# Altium project AUTOMATIC_WATER_PUMPS_V1.PrjPcb
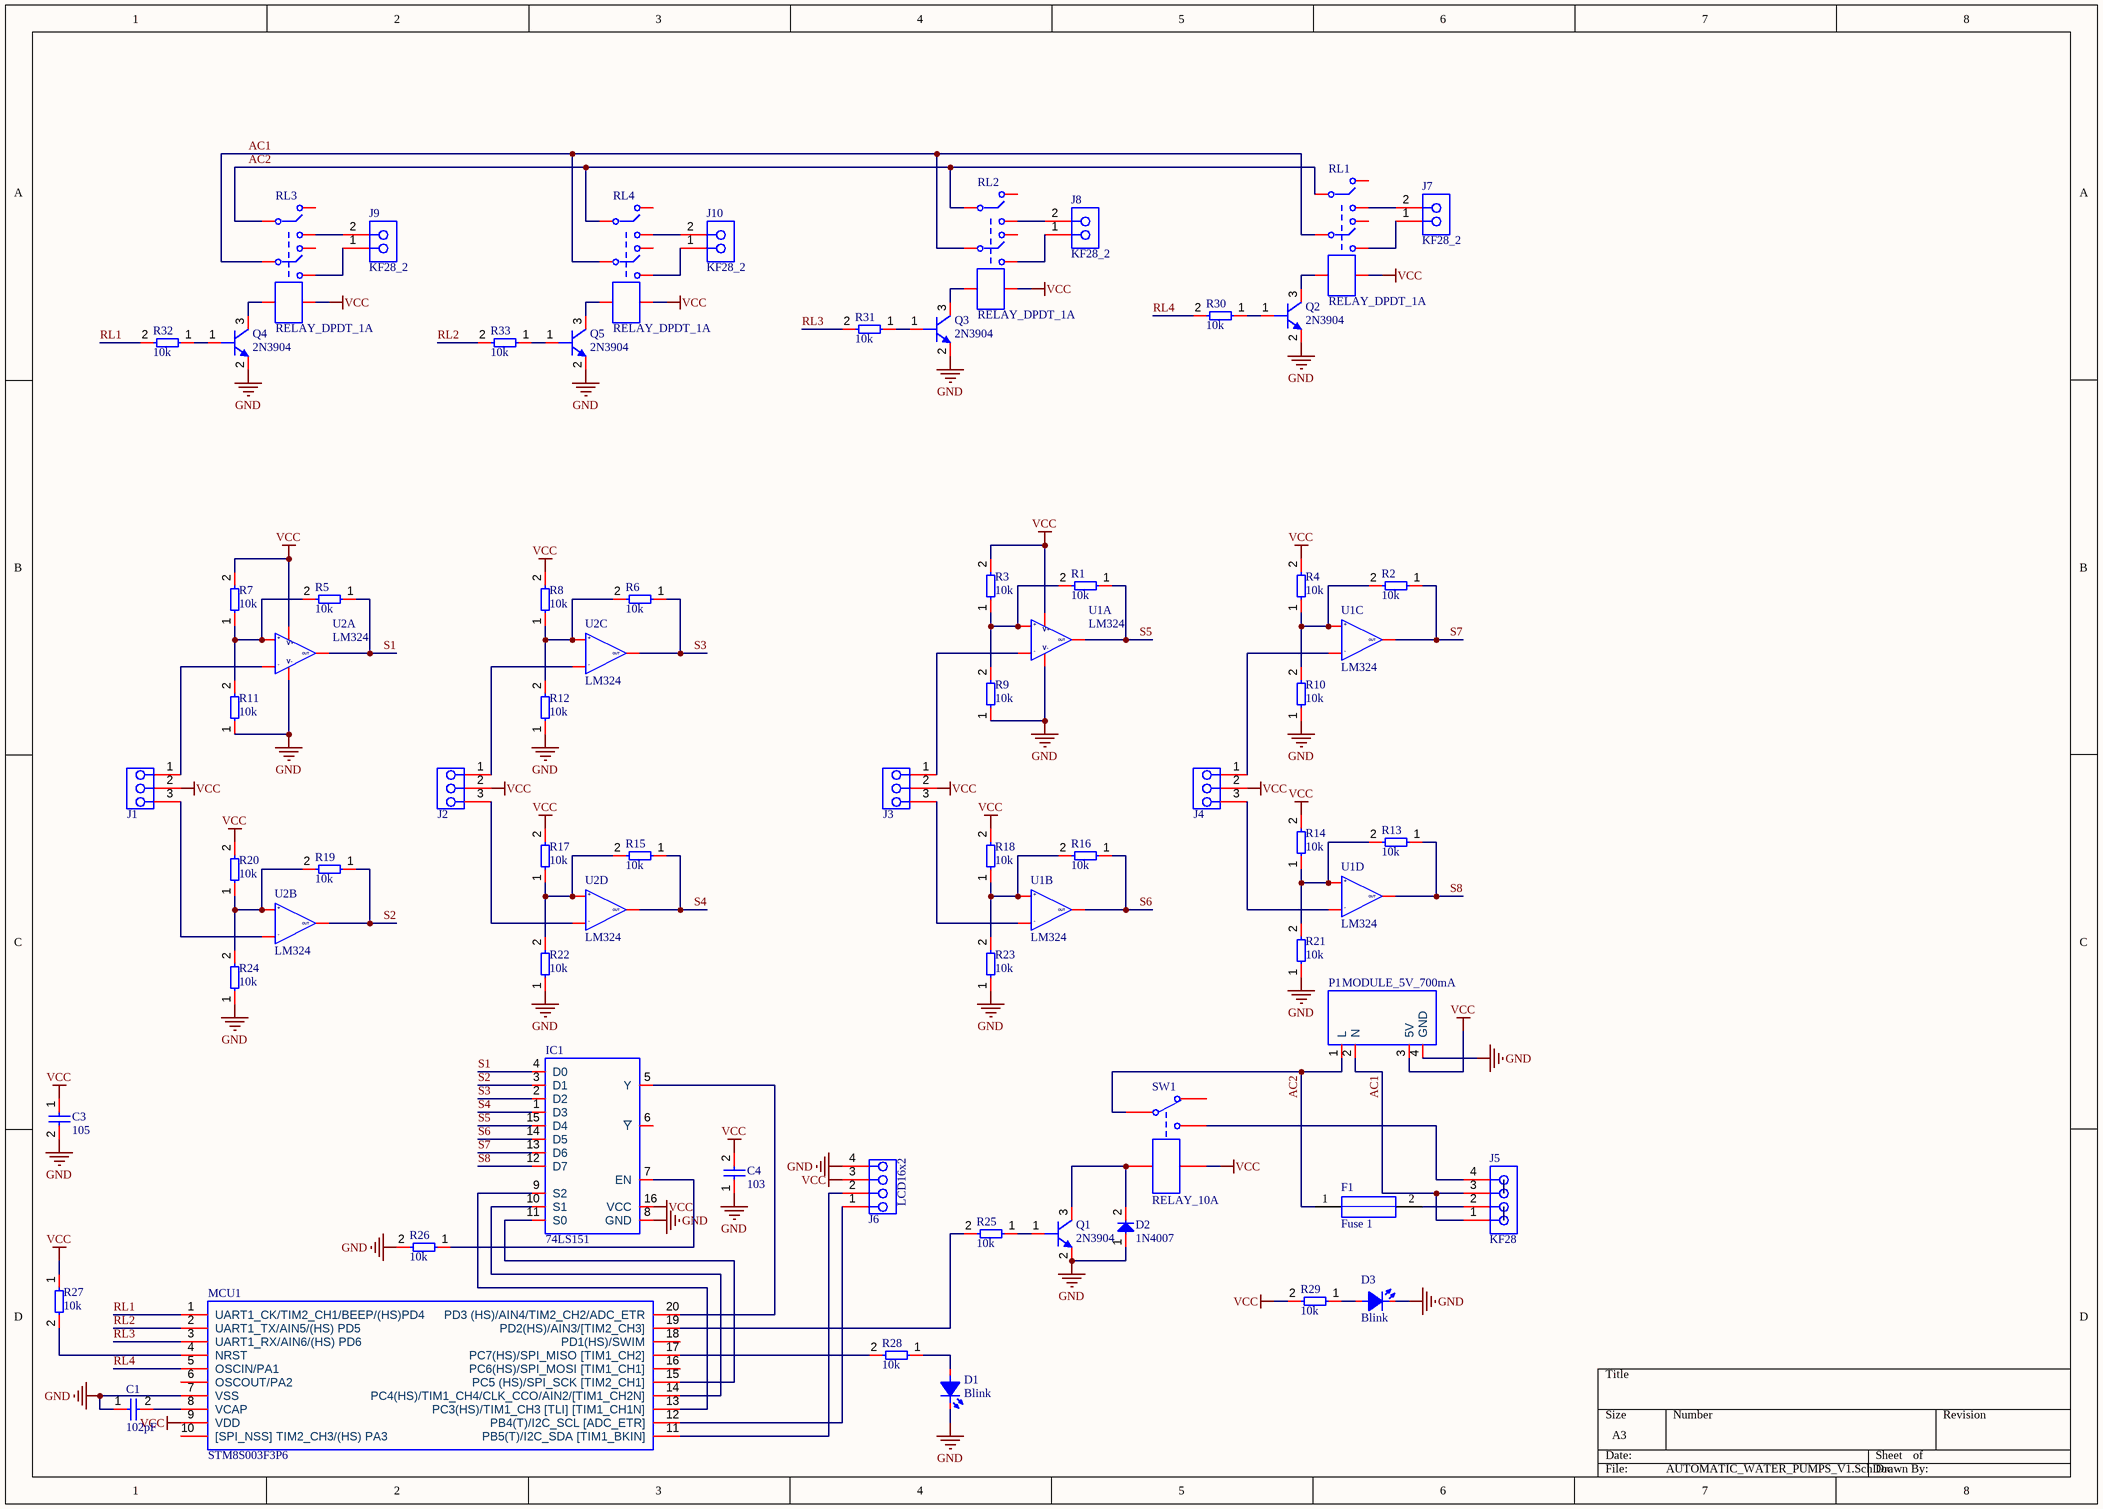
[diagram p0: AUTOMATIC_WATER_PUMPS_V1.SchDoc]
2 sheets, 107 parts. Net scope: global (net labels, ports and power ports of the same name join across sheets).
Board files: AUTOMATIC_WATER_PUMPS_V1.PcbDoc, DAUGHTER_BOARD.PcbDoc
Sheets:
  AUTOMATIC_WATER_PUMPS_V1.SchDoc
  DAUGHTER_BOARD.SchDoc

## Sheet AUTOMATIC_WATER_PUMPS_V1.SchDoc
size A3; SheetNumber: 1; SheetTotal: 1

### Parts
C1  102pF  [C0805]
C3  105  [C0805]
C4  103  [C0805]
D1  Blink  [L0805RED]
D2  1N4007  [DO-214AC(SMA)]
D3  Blink  [L0805RED]
F1  Fuse 1  [FUSE2]
IC1  74LS151  [SOP16]
J1  WT1  [JST - XH - Thru (R) - 3Pin - 2.54mm]  (value not drawn)
J2  WT2  [JST - XH - Thru (R) - 3Pin - 2.54mm]  (value not drawn)
J3  WT3  [JST - XH - Thru (R) - 3Pin - 2.54mm]  (value not drawn)
J4  WT4  [JST - XH - Thru (R) - 3Pin - 2.54mm]  (value not drawn)
J5  KF28  [HEADER_KF128_4_5.08MM]
J6  LCD16x2  [JST - XH - Thru (R) - 4Pin - 2.54mm]
J7  KF28_2  [HEADER_KF128_2_5.08MM]
J8  KF28_2  [HEADER_KF128_2_5.08MM]
J9  KF28_2  [HEADER_KF128_2_5.08MM]
J10  KF28_2  [HEADER_KF128_2_5.08MM]
MCU1  STM8S003F3P6  [TSSOP20_0.65_4.4]
P1  MODULE_5V_700mA  [MODULE_5V_700mA]
Q1  2N3904  [SOT23-3]
Q2  2N3904  [SOT23-3]
Q3  2N3904  [SOT23-3]
Q4  2N3904  [SOT23-3]
Q5  2N3904  [SOT23-3]
R1  10k  [R0805]
R2  10k  [R0805]
R3  10k  [R0805]
R4  10k  [R0805]
R5  10k  [R0805]
R6  10k  [R0805]
R7  10k  [R0805]
R8  10k  [R0805]
R9  10k  [R0805]
R10  10k  [R0805]
R11  10k  [R0805]
R12  10k  [R0805]
R13  10k  [R0805]
R14  10k  [R0805]
R15  10k  [R0805]
R16  10k  [R0805]
R17  10k  [R0805]
R18  10k  [R0805]
R19  10k  [R0805]
R20  10k  [R0805]
R21  10k  [R0805]
R22  10k  [R0805]
R23  10k  [R0805]
R24  10k  [R0805]
R25  10k  [R0805]
R26  10k  [R0805]
R27  10k  [R0805]
R28  10k  [R0805]
R29  10k  [R0805]
R30  10k  [R0805]
R31  10k  [R0805]
R32  10k  [R0805]
R33  10k  [R0805]
RL1  RELAY_DPDT_1A  [RELAY_DPDT_1A]
RL2  RELAY_DPDT_1A  [RELAY_DPDT_1A]
RL3  RELAY_DPDT_1A  [RELAY_DPDT_1A]
RL4  RELAY_DPDT_1A  [RELAY_DPDT_1A]
SW1  RELAY_10A  [RELAY_10A_5PIN]
U1  LM324  [SOP-14]  (parts A,B,C,D of 4)
U2  LM324  [SOP-14]  (parts A,B,C,D of 4)

### Nets
GND: C1.1 C3.2 C4.1 D1.2(K) D2.1 D3.2(K) IC1.8(GND) J6.4 MCU1.7(VSS) P1.4(GND) Q1.2(E) Q2.2(E) Q3.2(E) Q4.2(E) Q5.2(E) R9.1 R10.1 R11.1 R12.1 R21.1 R22.1 R23.1 R24.1 R26.2 U1.11 U2.11
VCC: C3.1 C4.2 IC1.16(VCC) J1.2 J2.2 J3.2 J4.2 J6.3 MCU1.9(VDD) P1.3(5V) R3.2 R4.2 R7.2 R8.2 R14.2 R17.2 R18.2 R20.2 R27.1 R29.2 RL1.8 RL2.8 RL3.8 RL4.8 SW1.3 U1.4 U2.4
AC1: J5.1 J5.3 P1.2(N) RL1.5 RL2.5 RL3.5 RL4.5
AC2: F1.1 P1.1(L) RL1.2 RL2.2 RL3.2 RL4.2 SW1.2
RL1: MCU1.1(UART1_CK/TIM2_CH1/BEEP/(HS)PD4) R32.2
RL2: MCU1.2(UART1_TX/AIN5/(HS)_PD5) R33.2
RL3: MCU1.3(UART1_RX/AIN6/(HS)_PD6) R31.2
RL4: MCU1.5(OSCIN/PA1) R30.2
S1: IC1.4(D0) R5.1 U2.1(OUT)
S2: IC1.3(D1) R19.1 U2.7(OUT)
S3: IC1.2(D2) R6.1 U2.8(OUT)
S4: IC1.1(D3) R15.1 U2.14(OUT)
S5: IC1.15(D4) R1.1 U1.1(OUT)
S6: IC1.14(D5) R16.1 U1.7(OUT)
S7: IC1.13(D6) R2.1 U1.8(OUT)
S8: IC1.12(D7) R13.1 U1.14(OUT)
NetC1_2: C1.2 MCU1.8(VCAP)
NetD1_1: D1.1(A) R28.1
NetD2_2: D2.2 Q1.3(C) SW1.1
NetD3_1: D3.1(A) R29.1
NetF1_2: F1.2 J5.2
NetIC1_5: IC1.5(Y) MCU1.20(PD3_(HS)/AIN4/TIM2_CH2/ADC_ETR)
NetIC1_7: IC1.7(EN) R26.1
NetIC1_9: IC1.9(S2) MCU1.13(PC3(HS)/TIM1_CH3_[TLI]_[TIM1_CH1N])
NetIC1_10: IC1.10(S1) MCU1.14(PC4(HS)/TIM1_CH4/CLK_CCO/AIN2/[TIM1_CH2N])
NetIC1_11: IC1.11(S0) MCU1.15(PC5_(HS)/SPI_SCK_[TIM2_CH1])
NetJ1_1: J1.1 U2.2(-)
NetJ1_3: J1.3 U2.6(-)
NetJ2_1: J2.1 U2.9(-)
NetJ2_3: J2.3 U2.13(-)
NetJ3_1: J3.1 U1.2(-)
NetJ3_3: J3.3 U1.6(-)
NetJ4_1: J4.1 U1.9(-)
NetJ4_3: J4.3 U1.13(-)
NetJ5_4: J5.4 SW1.5
NetJ6_1: J6.1 MCU1.12(PB4(T)/I2C_SCL_[ADC_ETR])
NetJ6_2: J6.2 MCU1.11(PB5(T)/I2C_SDA_[TIM1_BKIN])
NetJ7_1: J7.1 RL1.6
NetJ7_2: J7.2 RL1.3
NetJ8_1: J8.1 RL2.6
NetJ8_2: J8.2 RL2.3
NetJ9_1: J9.1 RL3.6
NetJ9_2: J9.2 RL3.3
NetJ10_1: J10.1 RL4.6
NetJ10_2: J10.2 RL4.3
NetMCU1_4: MCU1.4(NRST) R27.2
NetMCU1_17: MCU1.17(PC7(HS)/SPI_MISO_[TIM1_CH2]) R28.2
NetMCU1_19: MCU1.19(PD2(HS)/AIN3/[TIM2_CH3]) R25.2
NetQ1_1: Q1.1(B) R25.1
NetQ2_1: Q2.1(B) R30.1
NetQ2_3: Q2.3(C) RL1.7
NetQ3_1: Q3.1(B) R31.1
NetQ3_3: Q3.3(C) RL2.7
NetQ4_1: Q4.1(B) R32.1
NetQ4_3: Q4.3(C) RL3.7
NetQ5_1: Q5.1(B) R33.1
NetQ5_3: Q5.3(C) RL4.7
NetR1_2: R1.2 R3.1 R9.2 U1.3(+)
NetR2_2: R2.2 R4.1 R10.2 U1.10(+)
NetR5_2: R5.2 R7.1 R11.2 U2.3(+)
NetR6_2: R6.2 R8.1 R12.2 U2.10(+)
NetR13_2: R13.2 R14.1 R21.2 U1.12(+)
NetR15_2: R15.2 R17.1 R22.2 U2.12(+)
NetR16_2: R16.2 R18.1 R23.2 U1.5
NetR19_2: R19.2 R20.1 R24.2 U2.5

Not connected (* = marked no-connect by the designer): IC1 6(~{Y}); MCU1 6(OSCOUT/PA2) 10([SPI_NSS]_TIM2_CH3/(HS)_PA3) 16(PC6(HS)/SPI_MOSI_[TIM1_CH1]) 18(PD1(HS)/SWIM); RL1 1 4; RL2 1 4; RL3 1 4; RL4 1 4; SW1 4

### Notes on the sheet
- (in symbol LM324, part A) V+; V-

### Library data of the parts
C1 = Capacitors(SMD)
C3 C4 = C0805
D1 D3 = LED0805
D2 = Diode 1N4007-DO214AC(SMA)
IC1 = 74LS151: 8-input multiplexer
J1-J4 = JST - XH - Thru (R) - 3Pin - 2.54mm
J5 = HEADER_KF128_4_5.08MM
J6 = JST - XH - Thru (R) - 4Pin - 2.54mm
J7-J10 = HEADER_KF128_2_5.08MM
Q1-Q5 = 2N3904 (SOT-23)
R1-R33 = Resistor SMD
U1 U2 = LM324: Quad-Operational Amp
F1 = Fuse 1: Published: 8-Jun-2000; LatestRevisionDate: 17-Jul-2002; LatestRevisionNote: Re-released for DXP Platform.; PackageReference: PIN-W2/E2.8; Publisher: Altium Limited; PackageDescription: Thru-Hole; 2 Leads

## Sheet DAUGHTER_BOARD.SchDoc
size A4; SheetNumber: 2; SheetTotal: 2
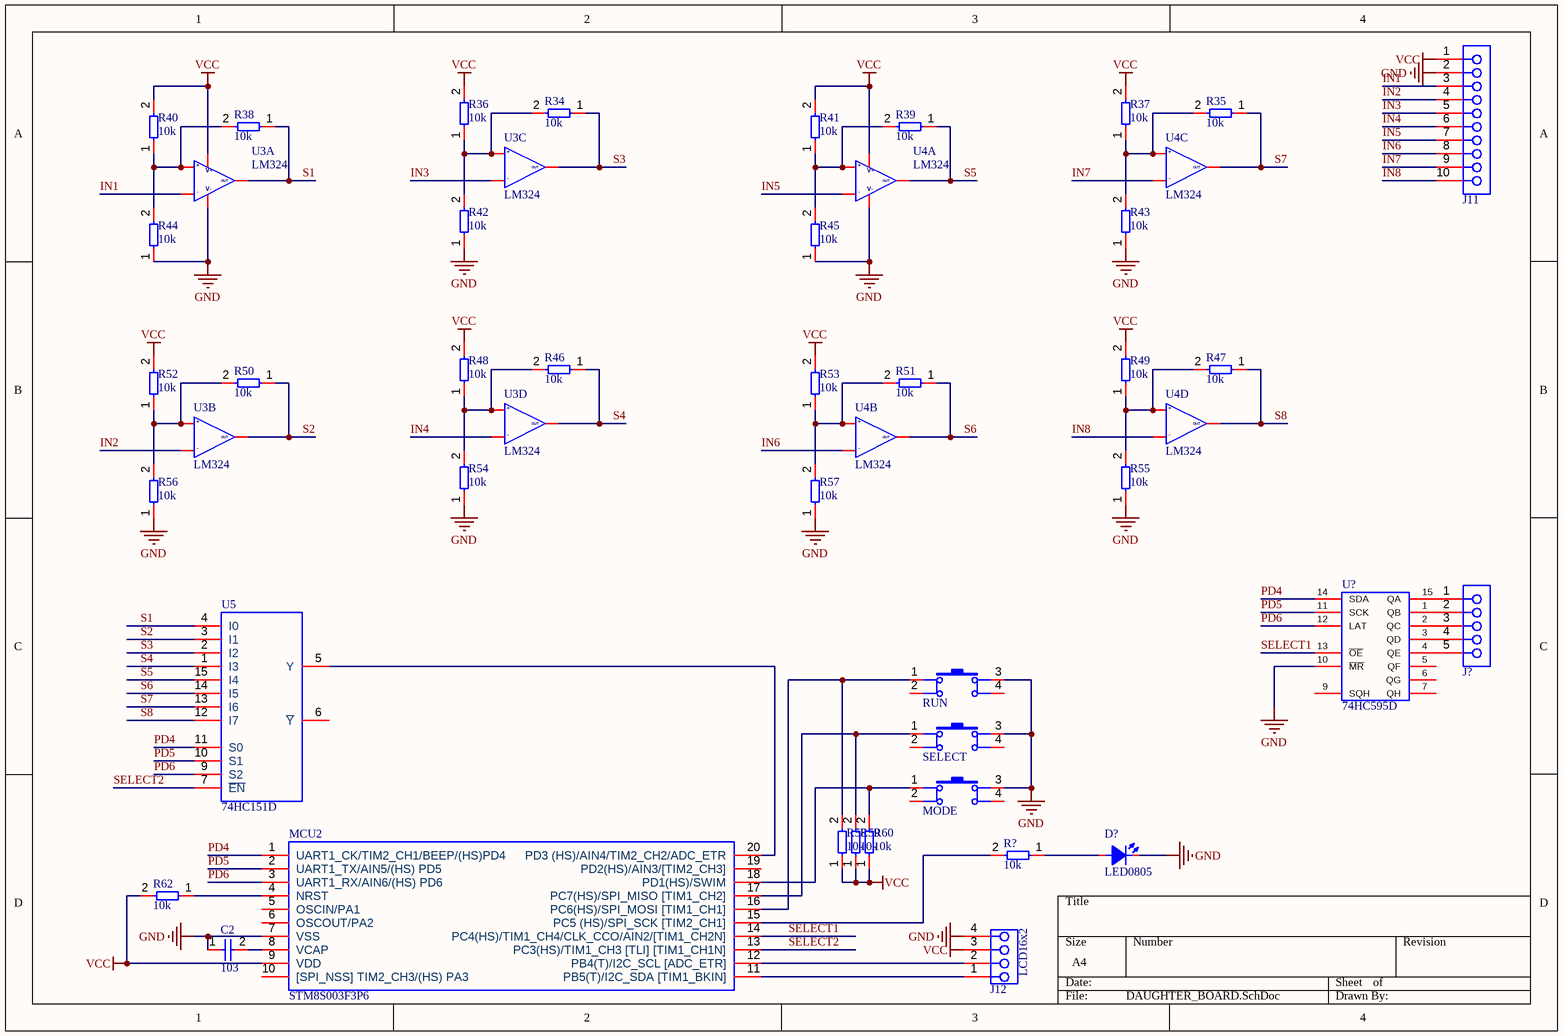
[diagram p1: DAUGHTER_BOARD.SchDoc]

### Parts
C2  103  [C0805]
D?  LED0805  [L0805RED]
J11  Header 10x1 TH Pitch 2.54mm  [Header 10x1 TH Pitch 2.54mm]  (value not drawn)
J12  LCD16x2  [JST - XH - Thru (R) - 4Pin - 2.54mm]
J?  Header 5x1 TH Pitch 2.54mm  [Header 5x1 TH Pitch 2.54mm]  (value not drawn)
MCU2  STM8S003F3P6  [TSSOP20_0.65_4.4]
MODE  Button Hole  [BUTTON_HOLE_4.3mm]  (value not drawn)
R34  10k  [R0805]
R35  10k  [R0805]
R36  10k  [R0805]
R37  10k  [R0805]
R38  10k  [R0805]
R39  10k  [R0805]
R40  10k  [R0805]
R41  10k  [R0805]
R42  10k  [R0805]
R43  10k  [R0805]
R44  10k  [R0805]
R45  10k  [R0805]
R46  10k  [R0805]
R47  10k  [R0805]
R48  10k  [R0805]
R49  10k  [R0805]
R50  10k  [R0805]
R51  10k  [R0805]
R52  10k  [R0805]
R53  10k  [R0805]
R54  10k  [R0805]
R55  10k  [R0805]
R56  10k  [R0805]
R57  10k  [R0805]
R58  10k  [R0805]
R59  10k  [R0805]
R60  10k  [R0805]
R62  10k  [R0805]
R?  10k  [R0805]
RUN  Button Hole  [BUTTON_HOLE_4.3mm]  (value not drawn)
SELECT  Button Hole  [BUTTON_HOLE_4.3mm]  (value not drawn)
U3  LM324  [SOP-14]  (parts A,B,C,D of 4)
U4  LM324  [SOP-14]  (parts A,B,C,D of 4)
U5  74HC151D  [SO16]
U?  74HC595D  [SO16]

### Nets
GND: C2.1 D?.2(K) J11.2 J12.4 MCU2.7(VSS) MODE.3 R42.1 R43.1 R44.1 R45.1 R54.1 R55.1 R56.1 R57.1 RUN.3 SELECT.3 U3.11 U4.11 U5.8 U?.8 U?.10(~{MR})
VCC: J11.1 J12.3 MCU2.9(VDD) R36.2 R37.2 R40.2 R41.2 R48.2 R49.2 R52.2 R53.2 R58.1 R59.1 R60.1 R62.2 U3.4 U4.4 U5.16 U?.16
IN1: J11.3 U3.2(-)
IN2: J11.4 U3.6(-)
IN3: J11.5 U3.9(-)
IN4: J11.6 U3.13(-)
IN5: J11.7 U4.2(-)
IN6: J11.8 U4.6(-)
IN7: J11.9 U4.9(-)
IN8: J11.10 U4.13(-)
PD4: MCU2.1(UART1_CK/TIM2_CH1/BEEP/(HS)PD4) U5.11(S0) U?.14(SDA)
PD5: MCU2.2(UART1_TX/AIN5/(HS)_PD5) U5.10(S1) U?.11(SCK)
PD6: MCU2.3(UART1_RX/AIN6/(HS)_PD6) U5.9(S2) U?.12(LAT)
S1: R38.1 U3.1(OUT) U5.4(I0)
S2: R50.1 U3.7(OUT) U5.3(I1)
S3: R34.1 U3.8(OUT) U5.2(I2)
S4: R46.1 U3.14(OUT) U5.1(I3)
S5: R39.1 U4.1(OUT) U5.15(I4)
S6: R51.1 U4.7(OUT) U5.14(I5)
S7: R35.1 U4.8(OUT) U5.13(I6)
S8: R47.1 U4.14(OUT) U5.12(I7)
SELECT1: MCU2.14(PC4(HS)/TIM1_CH4/CLK_CCO/AIN2/[TIM1_CH2N]) U?.13(~{OE})
SELECT2: MCU2.13(PC3(HS)/TIM1_CH3_[TLI]_[TIM1_CH1N]) U5.7(~{EN})
NetC2_2: C2.2 MCU2.8(VCAP)
NetD?_1: D?.1(A) R?.1
NetJ12_1: J12.1 MCU2.11(PB5(T)/I2C_SDA_[TIM1_BKIN])
NetJ12_2: J12.2 MCU2.12(PB4(T)/I2C_SCL_[ADC_ETR])
NetJ?_1: J?.1 U?.15(QA)
NetJ?_2: J?.2 U?.1(QB)
NetJ?_3: J?.3 U?.2(QC)
NetJ?_4: J?.4 U?.3(QD)
NetJ?_5: J?.5 U?.4(QE)
NetMCU2_4: MCU2.4(NRST) R62.1
NetMCU2_15: MCU2.15(PC5_(HS)/SPI_SCK_[TIM2_CH1]) R?.2
NetMCU2_16: MCU2.16(PC6(HS)/SPI_MOSI_[TIM1_CH1]) R58.2 RUN.1
NetMCU2_17: MCU2.17(PC7(HS)/SPI_MISO_[TIM1_CH2]) R59.2 SELECT.1
NetMCU2_18: MCU2.18(PD1(HS)/SWIM) MODE.1 R60.2
NetMCU2_20: MCU2.20(PD3_(HS)/AIN4/TIM2_CH2/ADC_ETR) U5.5(Y)
NetR34_2: R34.2 R36.1 R42.2 U3.10(+)
NetR35_2: R35.2 R37.1 R43.2 U4.10(+)
NetR38_2: R38.2 R40.1 R44.2 U3.3(+)
NetR39_2: R39.2 R41.1 R45.2 U4.3(+)
NetR46_2: R46.2 R48.1 R54.2 U3.12(+)
NetR47_2: R47.2 R49.1 R55.2 U4.12(+)
NetR50_2: R50.2 R52.1 R56.2 U3.5
NetR51_2: R51.2 R53.1 R57.2 U4.5

Not connected (* = marked no-connect by the designer): MCU2 5(OSCIN/PA1) 6(OSCOUT/PA2) 10([SPI_NSS]_TIM2_CH3/(HS)_PA3) 19(PD2(HS)/AIN3/[TIM2_CH3]); MODE 2 4; RUN 2 4; SELECT 2 4; U5 6(~{Y}); U? 5(QF) 6(QG) 7(QH) 9(SQH)

### Notes on the sheet
- (in symbol LM324, part A) V+; V-

### Library data of the parts
C2 = C0805
J12 = JST - XH - Thru (R) - 4Pin - 2.54mm
R34-R60 R62 R? = Resistor SMD
U3 U4 = LM324: Quad-Operational Amp

## Nets that join several sheets
GND: AUTOMATIC_WATER_PUMPS_V1 (26 pins), DAUGHTER_BOARD (21 pins)
VCC: AUTOMATIC_WATER_PUMPS_V1 (27 pins), DAUGHTER_BOARD (19 pins)
S1: AUTOMATIC_WATER_PUMPS_V1 (IC1.4 R5.1 U2.1), DAUGHTER_BOARD (R38.1 U3.1 U5.4)
S2: AUTOMATIC_WATER_PUMPS_V1 (IC1.3 R19.1 U2.7), DAUGHTER_BOARD (R50.1 U3.7 U5.3)
S3: AUTOMATIC_WATER_PUMPS_V1 (IC1.2 R6.1 U2.8), DAUGHTER_BOARD (R34.1 U3.8 U5.2)
S4: AUTOMATIC_WATER_PUMPS_V1 (IC1.1 R15.1 U2.14), DAUGHTER_BOARD (R46.1 U3.14 U5.1)
S5: AUTOMATIC_WATER_PUMPS_V1 (IC1.15 R1.1 U1.1), DAUGHTER_BOARD (R39.1 U4.1 U5.15)
S6: AUTOMATIC_WATER_PUMPS_V1 (IC1.14 R16.1 U1.7), DAUGHTER_BOARD (R51.1 U4.7 U5.14)
S7: AUTOMATIC_WATER_PUMPS_V1 (IC1.13 R2.1 U1.8), DAUGHTER_BOARD (R35.1 U4.8 U5.13)
S8: AUTOMATIC_WATER_PUMPS_V1 (IC1.12 R13.1 U1.14), DAUGHTER_BOARD (R47.1 U4.14 U5.12)